# Altium project EpicCubeDiagram.PrjPCB
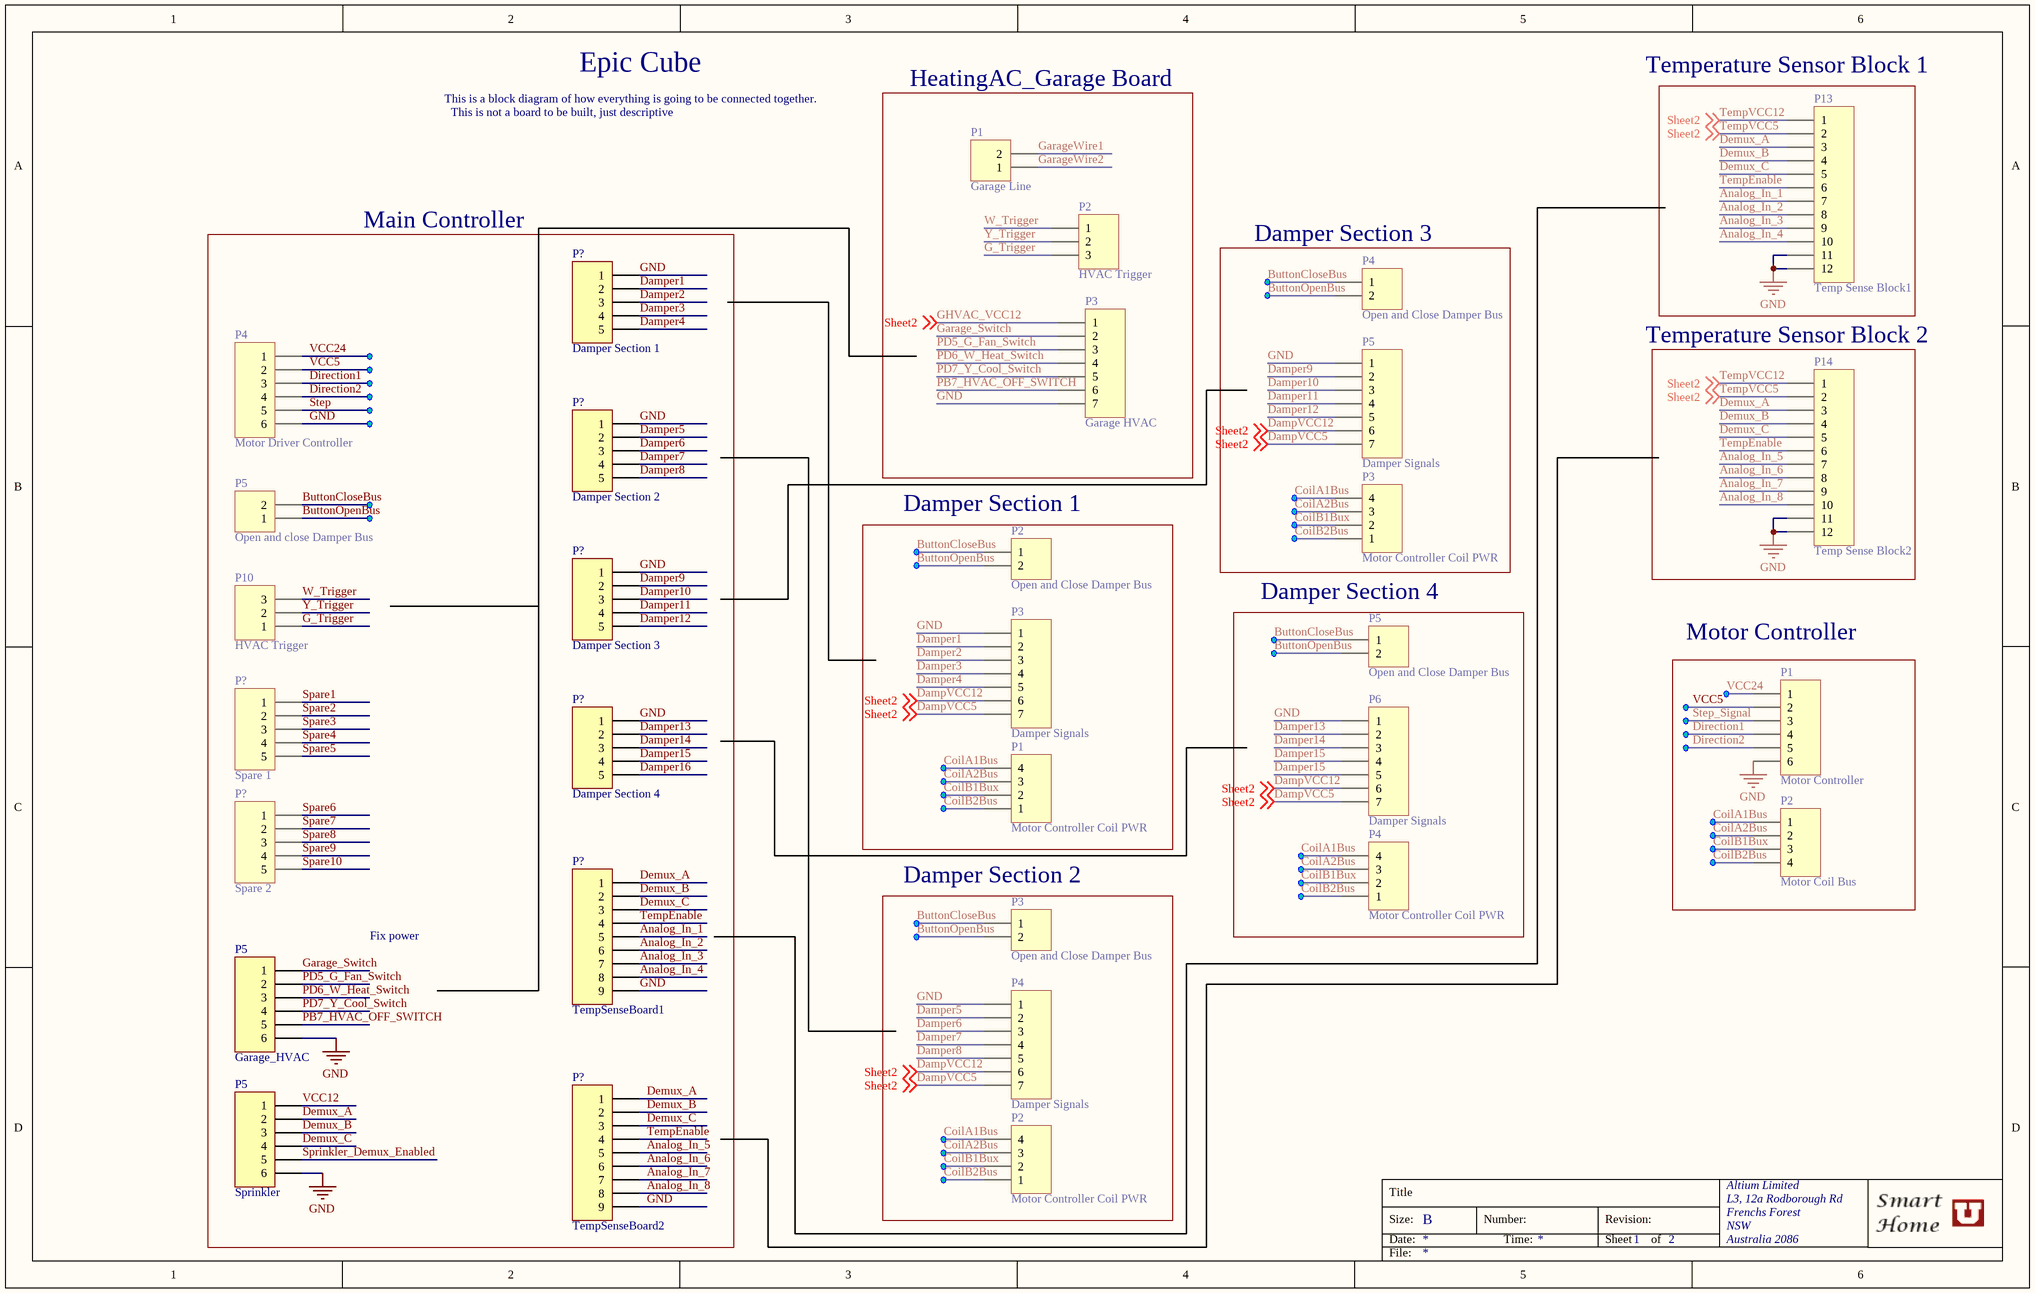
[diagram p0: EpicCubeDiagram.SchDoc]
2 sheets, 39 parts. Net scope: global (net labels, ports and power ports of the same name join across sheets).
Sheets:
  EpicCubeDiagram.SchDoc
  EpicCubeDiagram2.SchDoc

## Sheet EpicCubeDiagram.SchDoc
size B; Organization: Altium Limited; Address1: L3, 12a Rodborough Rd; Address2: Frenchs Forest; Address3: NSW; Address4: Australia 2086; SheetNumber: 1; SheetTotal: 2

### Parts
(Parts that share a designator on the sheet are numbered #1, #2 ... from top to bottom, then left to right.)
P1#1  Garage Line  [HDR1X2]
P1#2  Motor Controller  [HDR1X6]
P1#3  Motor Controller Coil PWR  [HDR1X4]
P2#1  HVAC Trigger  [HDR1X3]
P2#2  Open and Close Damper Bus  [HDR1X2]
P2#3  Motor Coil Bus  [HDR1X4]
P2#4  Motor Controller Coil PWR  [HDR1X4]
P3#1  Garage HVAC  [HDR1X7]
P3#2  Motor Controller Coil PWR  [HDR1X4]
P3#3  Damper Signals  [HDR1X7]
P3#4  Open and Close Damper Bus  [HDR1X2]
P4#1  Open and Close Damper Bus  [HDR1X2]
P4#2  Motor Driver Controller  [HDR1X6]
P4#3  Motor Controller Coil PWR  [HDR1X4]
P4#4  Damper Signals  [HDR1X7]
P5#1  Damper Signals  [HDR1X7]
P5#2  Open and close Damper Bus  [HDR1X2]
P5#3  Open and Close Damper Bus  [HDR1X2]
P5#4  Garage_HVAC  [HDR1X6]
P5#5  Sprinkler  [HDR1X6]
P6#1  Damper Signals  [HDR1X7]
P10  HVAC Trigger  [HDR1X3]
P13  Temp Sense Block1  [HDR1X12]
P14  Temp Sense Block2  [HDR1X12]
P?#1  Damper Section 1  [HDR1X5]
P?#2  Damper Section 2  [HDR1X5]
P?#3  Damper Section 3  [HDR1X5]
P?#4  Spare 1  [HDR1X5]
P?#5  Damper Section 4  [HDR1X5]
P?#6  Spare 2  [HDR1X5]
P?#7  TempSenseBoard1  [HDR1X9]
P?#8  TempSenseBoard2  [HDR1X9]

### Blocks framed on the sheet
HeatingAC_Garage Board: P1#1 P2#1 P3#1
Main Controller: P4#2 P5#2 P5#4 P5#5 P10 P?#1-P?#8
Damper Section 3: P3#2 P4#1 P5#1
Damper Section 1: P1#3 P2#2 P3#3
Damper Section 4: P4#3 P5#3 P6#1
Motor Controller: P1#2 P2#3
Damper Section 2: P2#4 P3#4 P4#4

### Nets
GND: P1#2.6 P3#1.7 P3#3.1 P4#2.6 P4#4.1 P5#1.1 P5#4.6 P5#5.6 P6#1.1 P13.11 P13.12 P14.11 P14.12 P?#1.1 P?#2.1 P?#3.1 P?#5.1 P?#7.9 P?#8.9
Analog_In_1: P13.7 P?#7.5
Analog_In_2: P13.8 P?#7.6
Analog_In_3: P13.9 P?#7.7
Analog_In_4: P13.10 P?#7.8
Analog_In_5: P14.7 P?#8.5
Analog_In_6: P14.8 P?#8.6
Analog_In_7: P14.9 P?#8.7
Analog_In_8: P14.10 P?#8.8
ButtonCloseBus: P2#2.1 P3#4.1 P4#1.1 P5#2.2 P5#3.1
ButtonOpenBus: P2#2.2 P3#4.2 P4#1.2 P5#2.1 P5#3.2
CoilA1Bus: P1#3.4 P2#3.1 P2#4.4 P3#2.4 P4#3.4
CoilA2Bus: P1#3.3 P2#3.2 P2#4.3 P3#2.3 P4#3.3
CoilB1Bux: P1#3.2 P2#3.3 P2#4.2 P3#2.2 P4#3.2
CoilB2Bus: P1#3.1 P2#3.4 P2#4.1 P3#2.1 P4#3.1
Damper1: P3#3.2 P?#1.2
Damper2: P3#3.3 P?#1.3
Damper3: P3#3.4 P?#1.4
Damper4: P3#3.5 P?#1.5
Damper5: P4#4.2 P?#2.2
Damper6: P4#4.3 P?#2.3
Damper7: P4#4.4 P?#2.4
Damper8: P4#4.5 P?#2.5
Damper9: P5#1.2 P?#3.2
Damper10: P5#1.3 P?#3.3
Damper11: P5#1.4 P?#3.4
Damper12: P5#1.5 P?#3.5
Damper13: P6#1.2 P?#5.2
Damper14: P6#1.3 P?#5.3
Damper15: P6#1.4 P6#1.5 P?#5.4
Damper16: P?#5.5
DampVCC12: P3#1.1 P3#3.6 P3#3.7 P4#4.6 P4#4.7 P5#1.6 P5#1.7 P6#1.6 P6#1.7 P13.1 P13.2 P14.1 P14.2 ; off-sheet Sheet2  [also labelled DampVCC5, GHVAC_VCC12, Sheet2, TempVCC12, TempVCC5]
Demux_A: P5#5.2 P13.3 P14.3 P?#7.1 P?#8.1
Demux_B: P5#5.3 P13.4 P14.4 P?#7.2 P?#8.2
Demux_C: P5#5.4 P13.5 P14.5 P?#7.3 P?#8.3
Direction1: P1#2.4 P4#2.3
Direction2: P1#2.5 P4#2.4
G_Trigger: P2#1.3 P10.1
Garage_Switch: P3#1.2 P5#4.1
GarageWire1: P1#1.2
GarageWire2: P1#1.1
PB7_HVAC_OFF_SWITCH: P3#1.6 P5#4.5
PD5_G_Fan_Switch: P3#1.3 P5#4.2
PD6_W_Heat_Switch: P3#1.4 P5#4.3
PD7_Y_Cool_Switch: P3#1.5 P5#4.4
Spare1: P?#4.1
Spare2: P?#4.2
Spare3: P?#4.3
Spare4: P?#4.4
Spare5: P?#4.5
Spare6: P?#6.1
Spare7: P?#6.2
Spare8: P?#6.3
Spare9: P?#6.4
Spare10: P?#6.5
Sprinkler_Demux_Enabled: P5#5.5
Step: P4#2.5
Step_Signal: P1#2.3
TempEnable: P13.6 P14.6 P?#7.4 P?#8.4
VCC5: P1#2.2 P4#2.2
VCC12: P5#5.1
VCC24: P1#2.1 P4#2.1
W_Trigger: P2#1.1 P10.3
Y_Trigger: P2#1.2 P10.2

### Notes on the sheet
- This is a block diagram of how everything is going to be connected together.
- Epic Cube
- (near P13) Temperature Sensor Block 1
- This is not a board to be built, just descriptive
- Temperature Sensor Block 2
- Fix power
- Title
- Size:
- Date:
- B
- Number:
- Time:
- Revision:
- Sheet
- of
- File:

### Library data of the parts
P1#1 P2#2 P3#4 P4#1 P5#2 P5#3 = Header 2: Header, 2-Pin; LatestRevisionDate: 17-Jul-2002; LatestRevisionNote: Re-released for DXP Platform.; Publisher: Altium Limited
P1#2 P4#2 P5#4 P5#5 = Header 6: Header, 6-Pin; LatestRevisionDate: 17-Jul-2002; LatestRevisionNote: Re-released for DXP Platform.; Publisher: Altium Limited
P1#3 P2#3 P2#4 P3#2 P4#3 = Header 4: Header, 4-Pin; LatestRevisionDate: 17-Jul-2002; LatestRevisionNote: Re-released for DXP Platform.; Publisher: Altium Limited
P2#1 P10 = Header 3: Header, 3-Pin; LatestRevisionDate: 17-Jul-2002; LatestRevisionNote: Re-released for DXP Platform.; Publisher: Altium Limited
P3#1 P3#3 P4#4 P5#1 P6#1 = Header 7: Header, 7-Pin; LatestRevisionDate: 17-Jul-2002; LatestRevisionNote: Re-released for DXP Platform.; Publisher: Altium Limited
P13 P14 = Header 12: Header, 12-Pin; LatestRevisionDate: 17-Jul-2002; LatestRevisionNote: Re-released for DXP Platform.; Publisher: Altium Limited
P?#1-P?#6 = Header 5: Header, 5-Pin; LatestRevisionDate: 17-Jul-2002; LatestRevisionNote: Re-released for DXP Platform.; Publisher: Altium Limited
P?#7 P?#8 = Header 9: Header, 9-Pin; LatestRevisionDate: 17-Jul-2002; LatestRevisionNote: Re-released for DXP Platform.; Publisher: Altium Limited

## Sheet EpicCubeDiagram2.SchDoc
size B; Organization: Altium Limited; Address1: L3, 12a Rodborough Rd; Address2: Frenchs Forest; Address3: NSW; Address4: Australia 2086; SheetNumber: 2; SheetTotal: 2
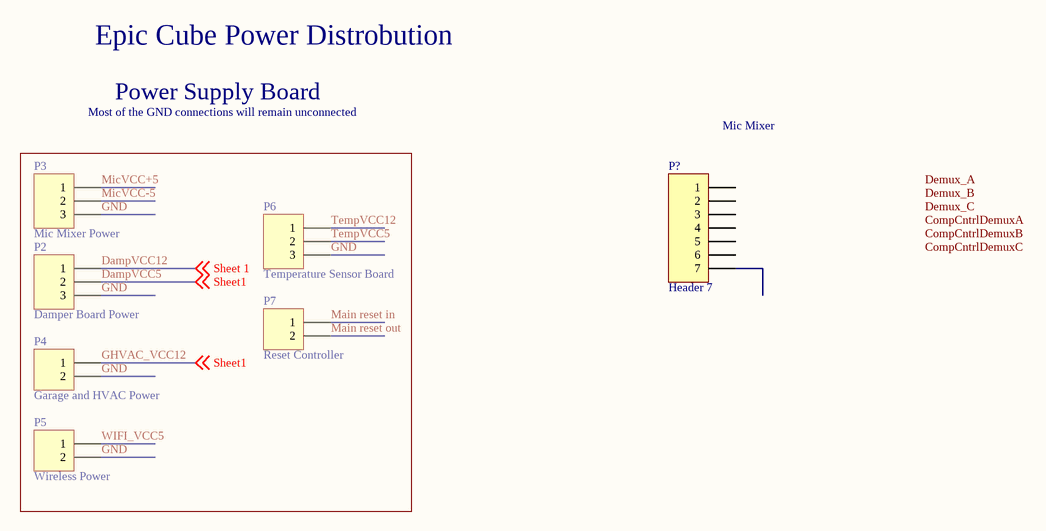
[diagram p1: EpicCubeDiagram2.SchDoc]

### Parts
(Parts that share a designator on the sheet are numbered #1, #2 ... from top to bottom, then left to right.)
P2#5  Damper Board Power  [HDR1X3]
P3#5  Mic Mixer Power  [HDR1X3]
P4#5  Garage and HVAC Power  [HDR1X2]
P5#6  Wireless Power  [HDR1X2]
P6#2  Temperature Sensor Board  [HDR1X3]
P7  Reset Controller  [HDR1X2]
P?#9  Header 7  [HDR1X7]

### Nets
GND: P2#5.3 P3#5.3 P4#5.2 P5#6.2 P6#2.3
DampVCC12: P2#5.1 P2#5.2 P4#5.1 P6#2.1 P6#2.2 ; off-sheet Sheet1, off-sheet Sheet 1  [also labelled DampVCC5, GHVAC_VCC12, Sheet 1, Sheet1, TempVCC12, TempVCC5]
Main reset in: P7.1
Main reset out: P7.2
MicVCC+5: P3#5.1
MicVCC-5: P3#5.2
WIFI_VCC5: P5#6.1

Not connected (* = marked no-connect by the designer): P?#9 1 2 3 4 5 6 7

### Notes on the sheet
- Epic Cube Power Distrobution
- Most of the GND connections will remain unconnected
- Power Supply Board
- Mic Mixer
- Labels drawn without touching a wire or pin: CompCntrlDemuxA, CompCntrlDemuxB, CompCntrlDemuxC, Demux_A, Demux_B, Demux_C
- Title
- Size:
- Date:
- B
- Number:
- Time:
- Revision:
- Sheet
- of
- File:

### Library data of the parts
P2#5 P3#5 P6#2 = Header 3: Header, 3-Pin; LatestRevisionDate: 17-Jul-2002; LatestRevisionNote: Re-released for DXP Platform.; Publisher: Altium Limited
P4#5 P5#6 P7 = Header 2: Header, 2-Pin; LatestRevisionDate: 17-Jul-2002; LatestRevisionNote: Re-released for DXP Platform.; Publisher: Altium Limited
P?#9 = Header 7: Header, 7-Pin; LatestRevisionDate: 17-Jul-2002; LatestRevisionNote: Re-released for DXP Platform.; Publisher: Altium Limited

## Nets that join several sheets
GND: EpicCubeDiagram (19 pins), EpicCubeDiagram2 (5 pins)
DampVCC12: EpicCubeDiagram (13 pins), EpicCubeDiagram2 (5 pins)